# Altium schematic sheet Peripheral.SchDoc
size A3; ApprovedBy: Mustafa Atılay Beycan; CheckedBy: Mustafa Atılay Beycan; Author: Mustafa Atılay Beycan; CompanyName: Mustafa Atılay Beycan; DrawnBy: Mustafa Atılay Beycan; Engineer: Mustafa Atılay Beycan; Organization: Mustafa Atılay Beycan; SheetNumber: 8; SheetTotal: 8; FilePath: https://github.com/mustafaatilay/Outdoor-Tracking-Project
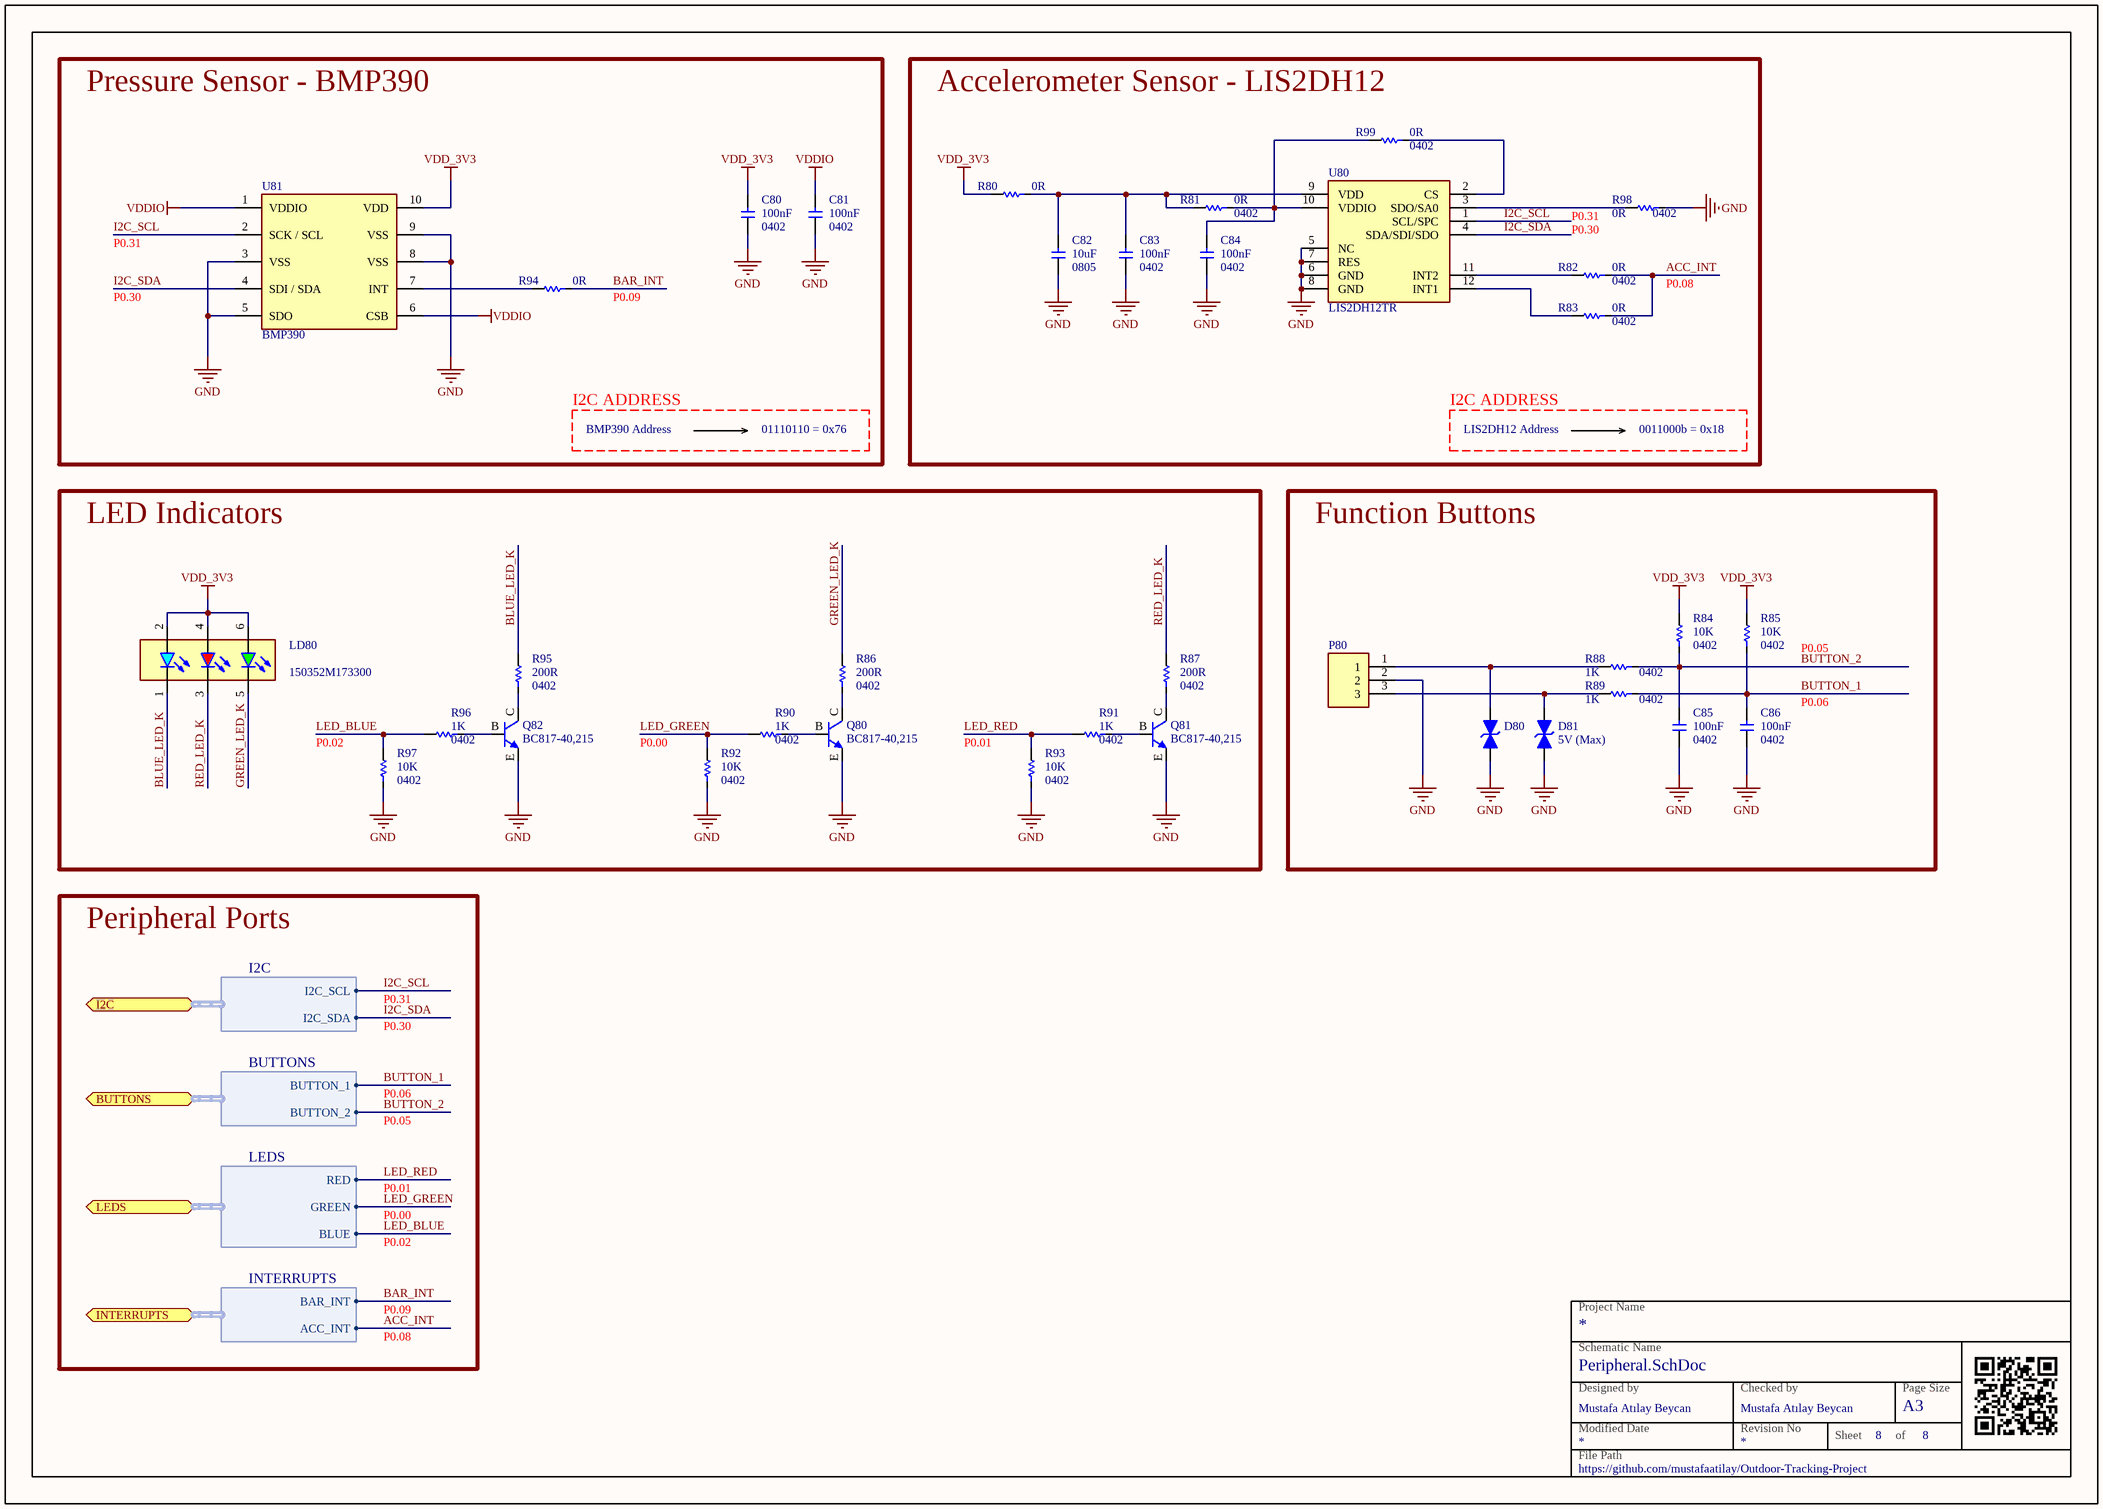
[diagram p0: Peripheral.SchDoc]

## Parts
C80  Capacitance: 100nF  Package: 0402  [CAP 0402]  (hidden comment: 100nF 10% X7R 16V 0402 SMD)
C81  Capacitance: 100nF  Package: 0402  [CAP 0402]  (hidden comment: 100nF 10% X7R 16V 0402 SMD)
C82  Capacitance: 10uF  Package: 0805  [CAP 0805]  (hidden comment: 10uF 10% X7R 10V 0805 SMD)
C83  Capacitance: 100nF  Package: 0402  [CAP 0402]  (hidden comment: 100nF 10% X7R 10V 0402 SMD)
C84  Capacitance: 100nF  Package: 0402  [CAP 0402]  (hidden comment: 100nF 10% X7R 10V 0402 SMD)
C85  Capacitance: 100nF  Package: 0402  [CAP 0402]  (hidden comment: 100nF 10% X7R 16V 0402 SMD)
C86  Capacitance: 100nF  Package: 0402  [CAP 0402]  (hidden comment: 100nF 10% X7R 16V 0402 SMD)
D80  D5V0L1B2LP4-7B  [DIODE 0402]  (value not drawn)
D81  Voltage - Reverse Standoff (Typ): 5V (Max)  [DIODE 0402]  (hidden comment: D5V0L1B2LP4-7B)
LD80  150352M173300  [LED RGB 150352M173300]
P80  HEADER 1 X 3 RA  [HDR 1X3 RA]  (value not drawn)
Q80  BC817-40,215  [TRAN SOT-23-3]
Q81  BC817-40,215  [TRAN SOT-23-3]
Q82  BC817-40,215  [TRAN SOT-23-3]
R80  Resistance: 0R  [RES 0402]  (hidden comment: 0R 5% * 0402 SMD)
R81  Resistance: 0R  Package: 0402  [RES 0402]  (hidden comment: 0R 5% * 0402 SMD)
R82  Resistance: 0R  Package: 0402  [RES 0402]  (hidden comment: 0R 5% * 0402 SMD)
R83  Resistance: 0R  Package: 0402  [RES 0402]  (hidden comment: 0R 5% * 0402 SMD)
R84  Resistance: 10K  Package: 0402  [RES 0402]  (hidden comment: 10K 5% 1/10W 0402 SMD)
R85  Resistance: 10K  Package: 0402  [RES 0402]  (hidden comment: 10K 5% 1/10W 0402 SMD)
R86  Resistance: 200R  Package: 0402  [RES 0402]  (hidden comment: 200R 5% 1/10W 0402 SMD)
R87  Resistance: 200R  Package: 0402  [RES 0402]  (hidden comment: 200R 5% 1/10W 0402 SMD)
R88  Resistance: 1K  Package: 0402  [RES 0402]  (hidden comment: 1K 5% 1/10W 0402 SMD)
R89  Resistance: 1K  Package: 0402  [RES 0402]  (hidden comment: 1K 5% 1/10W 0402 SMD)
R90  Resistance: 1K  Package: 0402  [RES 0402]  (hidden comment: 1K 5% 1/10W 0402 SMD)
R91  Resistance: 1K  Package: 0402  [RES 0402]  (hidden comment: 1K 5% 1/10W 0402 SMD)
R92  Resistance: 10K  Package: 0402  [RES 0402]  (hidden comment: 10K 5% 1/10W 0402 SMD)
R93  Resistance: 10K  Package: 0402  [RES 0402]  (hidden comment: 10K 5% 1/10W 0402 SMD)
R94  Resistance: 0R  [RES 0402]  (hidden comment: 0R 5% * 0402 SMD)
R95  Resistance: 200R  Package: 0402  [RES 0402]  (hidden comment: 200R 5% 1/10W 0402 SMD)
R96  Resistance: 1K  Package: 0402  [RES 0402]  (hidden comment: 1K 5% 1/10W 0402 SMD)
R97  Resistance: 10K  Package: 0402  [RES 0402]  (hidden comment: 10K 5% 1/10W 0402 SMD)
R98  Resistance: 0R  Package: 0402  [RES 0402]  (hidden comment: 0R 5% * 0402 SMD)
R99  Resistance: 0R  Package: 0402  [RES 0402]  (hidden comment: 0R 5% * 0402 SMD)
U80  LIS2DH12TR  [IC LGA-12 (2x2)]
U81  BMP390  [IC LGA-10 (2X2)]

## Blocks framed on the sheet
Pressure Sensor - BMP390: C80 C81 R94 U81
Accelerometer Sensor - LIS2DH12: C82-C84 R80-R83 R98 R99 U80
LED Indicators: LD80 Q80-Q82 R86 R87 R90-R93 R95-R97
Function Buttons: C85 C86 D80 D81 P80 R84 R85 R88 R89

## Ports
BUTTONS (bidir, harness BUTTONS), I2C (bidir, harness I2C), INTERRUPTS (bidir, harness INTERRUPTS), LEDS (bidir, harness LEDS)

## Harnesses
I2C: I2C_SCL, I2C_SDA
BUTTONS: BUTTON_1, BUTTON_2
LEDS: RED, GREEN, BLUE
INTERRUPTS: BAR_INT, ACC_INT

## Nets
GND: C80.2 C81.2 C82.2 C83.2 C84.2 C85.2 C86.2 D80.2 D81.2 P80.2 Q80.E Q81.E Q82.E R92.1 R93.1 R97.1 R98.1 U80.5(NC) U80.6(GND) U80.7(RES) U80.8(GND) U81.3(VSS) U81.5(SDO) U81.8(VSS) U81.9(VSS)
VDD_3V3: C80.1 LD80.2(A) LD80.4(A) LD80.6(A) R80.2 R84.2 R85.2 U81.10(VDD)
VDDIO: C81.1 U81.1(VDDIO) U81.6(CSB)
ACC_INT: R82.1 R83.1 ; port INTERRUPTS.ACC_INT
BAR_INT: R94.1 ; port INTERRUPTS.BAR_INT
BLUE_LED_K: LD80.1(K) R95.2
BUTTON_1: C86.1 R85.1 R89.1 ; port BUTTONS.BUTTON_1
BUTTON_2: C85.1 R84.1 R88.1 ; port BUTTONS.BUTTON_2
GREEN_LED_K: LD80.5(K) R86.2
I2C_SCL: U80.1(SCL/SPC) U81.2(SCK_/_SCL) ; port I2C.I2C_SCL
I2C_SDA: U80.4(SDA/SDI/SDO) U81.4(SDI_/_SDA) ; port I2C.I2C_SDA
LED_BLUE: R96.2 R97.2 ; port LEDS.BLUE
LED_GREEN: R90.2 R92.2 ; port LEDS.GREEN
LED_RED: R91.2 R93.2 ; port LEDS.RED
RED_LED_K: LD80.3(K) R87.2
NetC82_1: C82.1 C83.1 R80.1 R81.2 U80.9(VDD)
NetC84_1: C84.1 R81.1 R99.2 U80.10(VDDIO)
NetD80_1: D80.1 P80.1 R88.2
NetD81_1: D81.1 P80.3 R89.2
NetQ80_B: Q80.B R90.1
NetQ80_C: Q80.C R86.1
NetQ81_B: Q81.B R91.1
NetQ81_C: Q81.C R87.1
NetQ82_B: Q82.B R96.1
NetQ82_C: Q82.C R95.1
NetR82_2: R82.2 U80.11(INT2)
NetR83_2: R83.2 U80.12(INT1)
NetR94_2: R94.2 U81.7(INT)
NetR98_2: R98.2 U80.3(SDO/SA0)
NetR99_1: R99.1 U80.2(CS)

## Notes on the sheet
- P0.31
- P0.30
- (near R98) P0.31
- (near R94) P0.09
- P0.08
- I2C ADDRESS
- BMP390 Address
- 01110110 = 0x76
- LIS2DH12 Address
- 0011000b = 0x18
- P0.05
- P0.06
- (near R97) P0.02
- (near R92) P0.00
- (near R93) P0.01
- Peripheral Ports
- P0.01
- P0.00
- P0.02
- P0.09
- Project Name
- Designed by
- Schematic Name
- Checked by
- Page Size
- File Path
- Modified Date
- Revision No
- Sheet
- of
- A3

## Library data of the parts
C80 C81 C85 C86 = CAP 0402 100nF 16V: ALT MALZEME KODU: 1.009.00275; Link: *; Manufacturer: *; Manufacturer Part Number: *; Value: 100nF 10% X7R 16V 0402 SMD; Tolerance: 10%; TemperatureCoefficient: X7R; Mount: SMD; Voltage: 16V
C82 = CAP 0805 10uF 10V: ALT MALZEME KODU: 1.009.00295; Link: *; Manufacturer: *; Manufacturer Part Number: *; Value: 10uF 10% X7R 10V 0805 SMD; Tolerance: 10%; TemperatureCoefficient: X7R; Mount: SMD; Voltage: 10V
C83 C84 = CAP 0402 100nF 10V: ALT MALZEME KODU: 1.009.00840; Link: *; Manufacturer: *; Manufacturer Part Number: *; Value: 100nF 10% X7R 10V 0402 SMD; Tolerance: 10%; TemperatureCoefficient: X7R; Mount: SMD; Voltage: 10V
D80 = TVS D5V0L1B2LP4-7B: TVS DIODE 5VWM 14VC DFN1006-2; Manufacturer: Diodes Incorporated; Manufacturer Part Number: D5V0L1B2WS-7; Capacitance @ Frequency: 15pF @ 1MHz; Power Line Protection: No; Power - Peak Pulse: 84W; Current - Peak Pulse (10/1000µs): 6A (8/20µs); Voltage - Clamping (Max) @ Ipp: 14V; Voltage - Breakdown (Min): 6V; Bidirectional Channels: 1; Type: Zener; Voltage - Reverse Standoff (Typ): 5V (Max); Link: https://bit.ly/3Wt3y1t; ALT MALZEME KODU: *; Package: 0402; Mount: SMD
D81 = TVS D5V0L1B2LP4-7B: TVS DIODE 5VWM 14VC DFN1006-2; Manufacturer: Diodes Incorporated; Manufacturer Part Number: D5V0L1B2WS-7; Capacitance @ Frequency: 15pF @ 1MHz; Power Line Protection: No; Power - Peak Pulse: 84W; Current - Peak Pulse (10/1000µs): 6A (8/20µs); Voltage - Clamping (Max) @ Ipp: 14V; Voltage - Breakdown (Min): 6V; Bidirectional Channels: 1; Type: Zener; Link: https://bit.ly/3Wt3y1t; ALT MALZEME KODU: *; Package: 0402; Mount: SMD
LD80 = LED RGB 150352M173300: LED RGB CLEAR 6PLCC SMD; Manufacturer: Würth Elektronik; Voltage - Forward (Vf) (Typ): 2V Red, 3.2V Green, 3.2V Blue; Lens Color: Colorless; Color: Red, Green, Blue (RGB); Configuration: Independent; Manufacturer Product Number: 150352M173300; Link: https://bit.ly/4dLumjj
P80 = HEADER 1 X 3 RA: CONN HEADER 1 X 3 RA; ALT MALZEME KODU: 1.010.01029; Link: *; Manufacturer: *; Manufacturer Part Number: *; Mount: Through Hole
Q80-Q82 = NPN BC817-40,215: TRANS NPN 45V 0.5A SOT23; Manufacturer: Nexperia USA Inc.; Current - Collector: 500mA; Power: 250mW; Vce Saturation (Max) @ Ib, Ic: 700mV @ 50mA, 500mA; Voltage - Collector Emitter Breakdown: 45V (Max); ALT MALZEME KODU: 1.036.01085; Link: https://bit.ly/3mIUS1M; Manufacturer Part Number: BC817-40,215; Mount: SMD; Transistor Type: NPN; Package: SOT-23-3
R80-R83 R94 R98 R99 = RES 0402 0R 5%: ALT MALZEME KODU: 1.031.00612; Link: *; Manufacturer: *; Manufacturer Part Number: *; Value: 0R 5% * 0402 SMD; Tolerance: 5%; PowerRating: *; Mount: SMD
  R80 R94: Package: 0402
R84 R85 R92 R93 R97 = RES 0402 10K 5%: ALT MALZEME KODU: 1.031.00615; Link: *; Manufacturer: *; Manufacturer Part Number: *; Value: 10K 5% 1/10W 0402 SMD; Tolerance: 5%; PowerRating: 1/10W; Mount: SMD
R86 R87 R95 = RES 0402 200R 5%: ALT MALZEME KODU: 1.031.00643; Link: *; Manufacturer: *; Manufacturer Part Number: *; Value: 200R 5% 1/10W 0402 SMD; PowerRating: 1/10W; Mount: SMD; Tolerance: 5%
R88-R91 R96 = RES 0402 1K 5%: ALT MALZEME KODU: 1.031.00622; Link: *; Manufacturer: *; Manufacturer Part Number: *; Value: 1K 5% 1/10W 0402 SMD; PowerRating: 1/10W; Mount: SMD; Tolerance: 5%
U80 = IC LIS2DH12TR: ACCELEROMETER MEMS 3 AXIS 16G; Manufacturer: STMicroelectronics; Min Supply Voltage: 1.71V; Max Supply Voltage: 3.6V; Bandwidth: 672Hz; Interface: I2C,SPI; Output Type: SPI,I2C,Digital; Axis: X, Y, Z; Supplier 1: Digi-Key; Manufacturer Part Number: LIS2DH12TR; RoHS: Yes; Category: Accelerometers; Mount: Surface Mount; Case/Package: LGA; Number of Pins: 12; Contact Plating: Gold; Min Operating Temperature: -40°C; Max Operating Temperature: 85°C; Packaging: Cut Tape; Length: 2.15mm; Width: 2.15mm; Height: 1mm; Radiation Hardening: No; REACH SVHC: No SVHC; Lead Free: Lead Free; RoHS Compliant: Yes; ComponentLink1URL: https://datasheet.ciiva.com/46423/1836729-46423946.pdf?src-supplier=Element14; ComponentLink1Description: https://datasheet.ciiva.com/46423/1836729-46423946.pdf?src-supplier=Element14; Link: https://bit.ly/3goFJVF; Supplier Part Number 1: 497-14851-1-ND; ALT MALZEME KODU: *
U81 = IC BMP390: SENSOR 18.13PSIA 10LGA; Manufacturer: Bosch Sensortec; Pressure Type: Absolute; Operating Pressure: 4.35PSI ~ 18.13PSI (30kPa ~ 125kPa); Output Type: I2C, SPI; Accuracy: ±0.01PSI (0.05kPa); Voltage - Supply: 1.65V ~ 3.6V; Maximum Pressure: 290.08PSI (2000kPa); Link: https://bit.ly/4bnh8aY